# Altium schematic sheet XC7A35TFTG256_config.SchDoc
size A4; DocumentNumber: 14; SheetNumber: 14; SheetTotal: 21; SheetName: FPGA Configuration Top Level
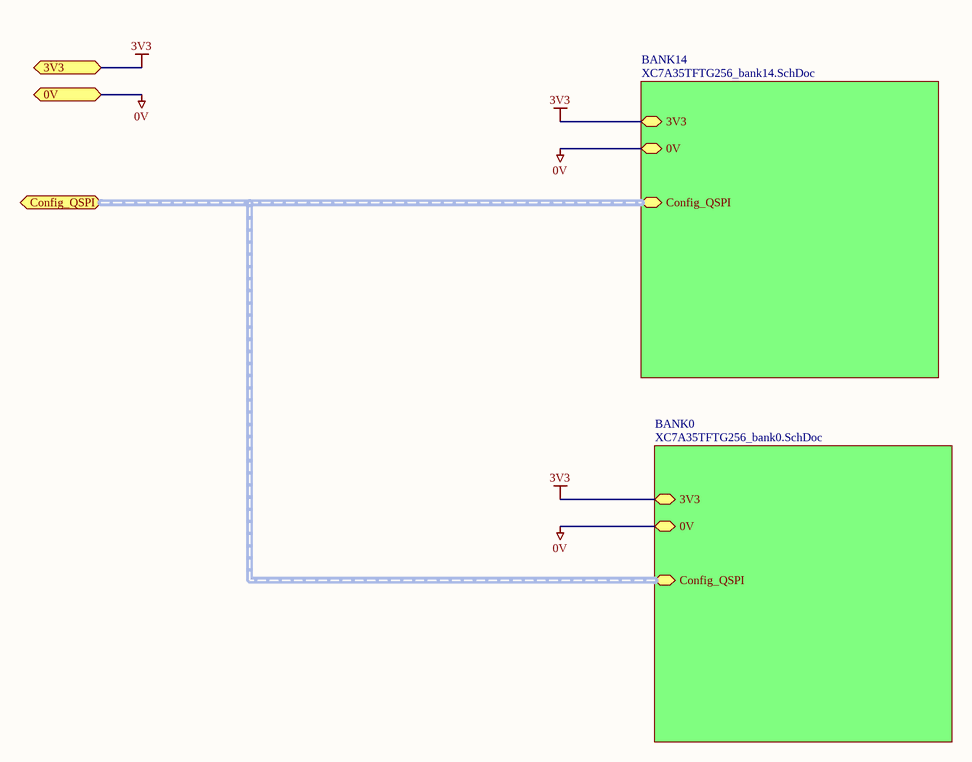
[diagram p0: XC7A35TFTG256_config.SchDoc]

## Sub-sheets
BANK0 = XC7A35TFTG256_bank0.SchDoc: Config_QSPI (harness QSPI), 0V, 3V3
BANK14 = XC7A35TFTG256_bank14.SchDoc: Config_QSPI (harness QSPI), 3V3, 0V

## Ports
0V, 3V3, Config_QSPI (harness QSPI)

## Nets
0V: port 0V, sheet BANK14/0V, sheet BANK0/0V
3V3: port 3V3, sheet BANK14/3V3, sheet BANK0/3V3

## Buses and harness runs
harness port Config_QSPI = sheet BANK0/Config_QSPI = sheet BANK14/Config_QSPI

## Notes on the sheet
- Board:
- Version:
- Sheetname:
- Subject:
- Group:
- Sheet
- of
- Shematic file: